# Altium schematic sheet MCU.SchDoc
size A4; SheetNumber: 2; SheetTotal: 5
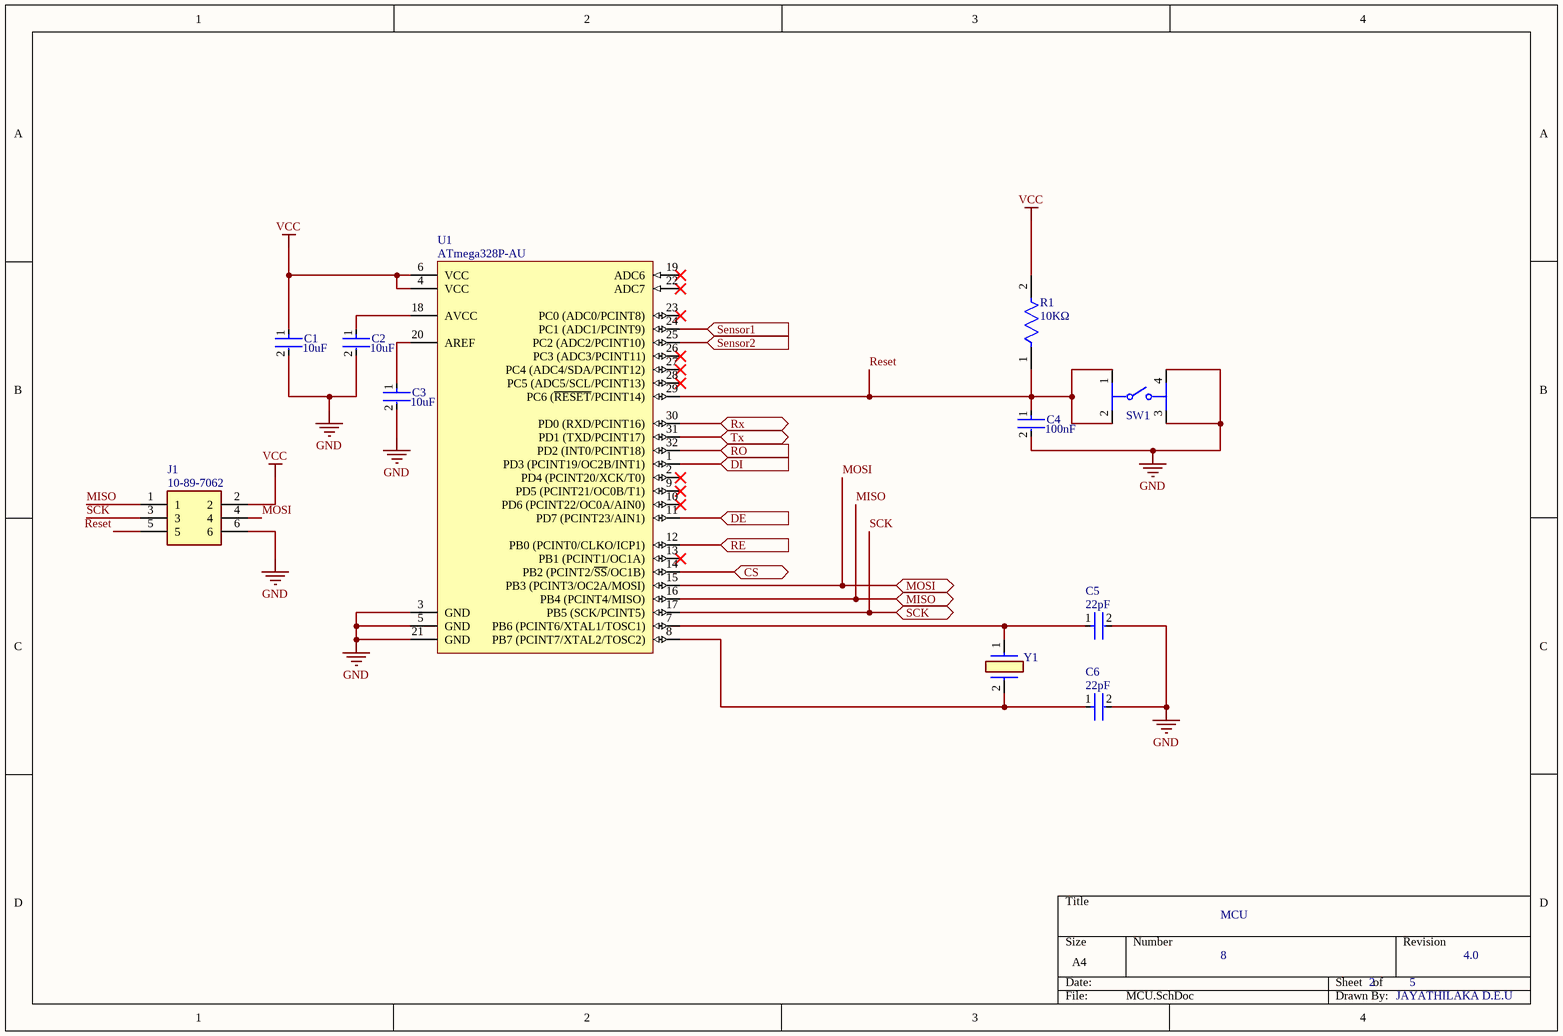
[diagram p0: MCU.SchDoc]

## Parts
C1  value 10uF  [FP-CL31B106KBHNNNE-MFG]  (hidden comment: CL31B106KBHNNNE)
C2  value 10uF  [FP-CL31B106KBHNNNE-MFG]  (hidden comment: CL31B106KBHNNNE)
C3  value 10uF  [FP-CL31B106KBHNNNE-MFG]  (hidden comment: CL31B106KBHNNNE)
C4  Capacitance: 100nF  [FP-GRM31C-0_2-e0_3_0_8-IPC_B]  (hidden comment: GRM31C5C1H104JA01L)
C5  Capacitance: 22pF  [FP-GRM31A-0_2-e0_3_0_95-IPC_C]  (hidden comment: GRM31A5C2J220JW01D)
C6  Capacitance: 22pF  [FP-GRM31A-0_2-e0_3_0_95-IPC_C]  (hidden comment: GRM31A5C2J220JW01D)
J1  10-89-7062  [HDRV6W87P254_2X3_775X508X864P]
R1  Resistance: 10KΩ  [FP-RT1206-MFG]  (hidden comment: RT1206BRD0710KL)
SW1  1571634-2  [FP-1571634-2-MFG]  (value not drawn)
U1  ATmega328P-AU  [32A_M]
Y1  ECS-160-20-3X-TR  [ECS160203XTR]  (value not drawn)

## Ports
CS (bidir, see Farm Assistor[3B], Data Logger[3C]), DE (in, see Farm Assistor[2B], Sensor inputs[4C]), DI (in, see Farm Assistor[2B], Sensor inputs[4C]), MISO (bidir, see Farm Assistor[3B], Data Logger[3C]), MOSI (bidir, see Farm Assistor[3B], Data Logger[1C]), RE (in, see Farm Assistor[2B], Sensor inputs[4C]), RO (in, see Farm Assistor[2B], Sensor inputs[4B]), Rx (bidir, see Farm Assistor[3B], Data Logger[2D]), SCK (bidir, see Farm Assistor[3B], Data Logger[1C]), Sensor1 (in, see Farm Assistor[2B], Sensor inputs[1A]), Sensor2 (in, see Farm Assistor[2B], Sensor inputs[1B]), Tx (bidir, see Farm Assistor[3B], Data Logger[2D])

## Nets
GND: C1.2 C2.2 C3.2 C4.2 C5.2 C6.2 J1.6 SW1.3 SW1.4 U1.3(GND) U1.5(GND) U1.21(GND)
VCC: C1.1 J1.2 R1.2 U1.4(VCC) U1.6(VCC)
CS: U1.14(PB2_(PCINT2/~{SS}/OC1B)) ; port CS
DE: U1.11(PD7_(PCINT23/AIN1)) ; port DE
DI: U1.1(PD3_(PCINT19/OC2B/INT1)) ; port DI
MISO: J1.1 U1.16(PB4_(PCINT4/MISO)) ; port MISO
MOSI: J1.4 U1.15(PB3_(PCINT3/OC2A/MOSI)) ; port MOSI
RE: U1.12(PB0_(PCINT0/CLKO/ICP1)) ; port RE
Reset: C4.1 J1.5 R1.1 SW1.1 SW1.2 U1.29(PC6_(~{RESET}/PCINT14))
RO: U1.32(PD2_(INT0/PCINT18)) ; port RO
Rx: U1.30(PD0_(RXD/PCINT16)) ; port Rx
SCK: J1.3 U1.17(PB5_(SCK/PCINT5)) ; port SCK
Sensor1: U1.24(PC1_(ADC1/PCINT9)) ; port Sensor1
Sensor2: U1.25(PC2_(ADC2/PCINT10)) ; port Sensor2
Tx: U1.31(PD1_(TXD/PCINT17)) ; port Tx
NetC2_1: C2.1 U1.18(AVCC)
NetC3_1: C3.1 U1.20(AREF)
NetC5_1: C5.1 U1.7(PB6_(PCINT6/XTAL1/TOSC1)) Y1.1(X1)
NetC6_1: C6.1 U1.8(PB7_(PCINT7/XTAL2/TOSC2)) Y1.2(X2)

Not connected (* = marked no-connect by the designer): U1 2(PD4_(PCINT20/XCK/T0))* 9(PD5_(PCINT21/OC0B/T1))* 10(PD6_(PCINT22/OC0A/AIN0))* 13(PB1_(PCINT1/OC1A))* 19(ADC6)* 22(ADC7)* 23(PC0_(ADC0/PCINT8))* 26(PC3_(ADC3/PCINT11))* 27(PC4_(ADC4/SDA/PCINT12))* 28(PC5_(ADC5/SCL/PCINT13))*

## Notes on the sheet
- MCU
- 8
- 2
- 5
- 4.0
- JAYATHILAKA D.E.U

## Library data of the parts
C1-C3 = CMP-2000-07530-2: CAP CER 10UF 50V X7R 1206; Manufacturer: Samsung; Tolerance: 10%; Material: Ceramic; Temperature Coefficient: 15%; Temperature Characteristic: X7R; Digikey Description: CAP CER 10UF 50V X7R 1206; Device Class L1: Passive Components; Lead Free: Yes; Device Class L3: Ceramic Capacitors; Octopart: https://octopart.com/cl31b106kbhnnne-samsung-30507377; ComponentLink2URL: http://www.samsungsem.com/global/front/downloadcms.do?path=%2F%2Fglobal%2F%2Fsupport%2F%2Fproduct-search%2F%2Fmlcc%2F%2F__icsFiles%2F%2Fafieldfile%2F%2F2019%2F%2F06%2F%2F18&fileName=CL31B106KBHNNNE-19.pdf; Voltage Rating: 50V; Temperature Range Low: -55°C; RoHS: TRUE; Temperature: -55°C to +125°C; Category: Cap; ComponentLink2Description: Datasheet; Manufacturer Part Number: CL31B106KBHNNNE; Automotive: No; Device Class L2: Capacitors; Capacitance: 10uF; Height: 1.8mm; Temperature Range High: +125°C; Package: CL31B106KBHNNNE
C4 = CMP-06035-003994-1: Chip Multilayer Ceramic Capacitors for General Purpose, 1206, 0.10uF, C0G, 30ppm/°C, 5%, 50V; Voltage: 50V; Package Quantity: 1; Min Operating Temperature: -55°C; Termination: SMD/SMT; Voltage Rating (DC): 50V; Thickness: 0.071inch; Max Operating Temperature: 125°C; Mount: Surface Mount; Height: 1.6mm; Weight: 0.000571oz; Length: 3.2mm; Case Code (Imperial): 1206; Tolerance: 5%; Lead Free: Lead Free; Material: Ceramic; REACH SVHC: No SVHC; Depth: 1.6mm; Case/Package: 1206; Radiation Hardening: No; Temperature Coefficient: 30ppm/°C; Packaging: Tape and Reel; Case Code (Metric): 3216; Dielectric: C0G; Width: 0.063inch; Voltage Rating: 50V
C5 C6 = CMP-06035-015531-1: Chip Multilayer Ceramic Capacitors for General Purpose, 1206, 22pF, C0G, 30ppm/°C, 5%, 630V; Length: 3.2mm; Case/Package: 1206; Voltage Rating (DC): 630V; Width: 0.063inch; Package Quantity: 4000; REACH SVHC: No SVHC; Radiation Hardening: No; Mount: Surface Mount; Depth: 1.6mm; Height: 1mm; Packaging: Tape and Reel; Voltage Rating: 630V; Tolerance: 5%; Termination: SMD/SMT; Thickness: 0.039inch; Case Code (Imperial): 1206; Dielectric: C0G; Lead Free: Lead Free; Case Code (Metric): 3216; Voltage: 630V; Max Operating Temperature: 125°C; Min Operating Temperature: -55°C
J1 = 10-89-7062: Connector; Manufacturer_Name: Molex; Datasheet Link: https://componentsearchengine.com/Datasheets/1/10-89-7062.pdf; Height: 8.64mm; Manufacturer_Part_Number: 10-89-7062; Mouser Part Number: 538-10-89-7062; Mouser Price/Stock: https://www.mouser.co.uk/ProductDetail/Molex/10-89-7062?qs=tRPrwvvr%2Fuh8n6rY9aRt4Q%3D%3D
R1 = CMP-2003-04273-2: RES 10.0K OHM 1/4W .1% SMD 1206; Manufacturer: Yageo; Power Rating: 0.25W; Temperature Coefficient: 25 ppm/°C; Voltage Rating: 200V; Value: 10KΩ; Tolerance: 0.005; ComponentLink2URL: http://www.yageo.com/documents/recent/PYu-RT_1-to-0.01_RoHS_L_9.pdf; ComponentLink2Description: Datasheet; Series: RT; Octopart: https://octopart.com/rt1206brd0710kl-yageo-1397513; Footprint Url: http://www.yageo.com/exep/pages/download/literatures/PYu-R_Mount_10.pdf; Manufacturer Part Number: RT1206BRD0710KL; Temperature: -55°C to +155°C; Digikey Description: RES 10.0K OHM 1/4W .1% SMD 1206; Ipc Land Pattern Name: RESC310160X55; Temperature Range Low: -55°C; Mouser Description: High Precision-High Stability Chip Resistor Thin Film 1206 10kOhm 0.1% Paper T/R; Composition: Thin Film; Category: Res; Temperature Range High: +155°C; Device Class L1: Passive Components; Height: 0.65mm; Package: RT1206; Lead Free: Yes; RoHS: TRUE; Device Class L2: Resistors; Device Class L3: Chip SMD Resistors; Automotive: No
SW1 = CMP-03407-000008-1: SWITCH TACTILE SPST-NO 0.05A 24V; Actuator Length: 0.094inch; Max Current Rating: 50mA; Voltage Rating (DC): 12V; Actuator Material: Rubber; Switch Function: Off-Mom; Mechanical Life: 5000000Cycles; Actuator Type: Standard; Actuator Color: Natural; Illumination Type: Illuminated; Operating Force: 160gf; Throw Configuration: SPST; Package Quantity: 1000; Max Operating Temperature: 85°C; Mount: Surface Mount; Contact Plating: Silver; Depth: 10mm; Min Operating Temperature: -40°C; Radiation Hardening: No; ELV: Compliant; Case/Package: SMD/SMT; Length: 6.2mm; Termination: Gull Wing; Type: Switch; RoHS Compliant: Yes; Current Rating: 50mA; Contact Current Rating: 50mA; Orientation: Straight; Packaging: Tape and Reel; Max Voltage Rating (DC): 12V; Lead Free: Lead Free; Contact Material: Stainless Steel
U1 = CMP-0095-00269-2: 8-bit AVR Microcontroller, 32KB Flash, 1KB EEPROM, 2KB SRAM, 32-pin TQFP, Industrial Grade (-40°C to 85°C); PackageDescription: 32-Lead, 7x7x1.0 mm Body, 0.8mm Lead Pitch, Thin Profile Plastic Quad Flat Package (TQFP); DatasheetVersion: revD, May-2011; RevisionNote: DatasheetVersion & PackageVersion updated. URLs added.; ComponentLink1URL: http://www.atmel.com/; ComponentLink2Description: ATmega48A/48PA/88A/88PA/168A/168PA/328/328P Datasheet; Code_JEDEC: MS-026-ABA; ComponentLink1Description: Manufacturer URL; PackageReference: 32A; ComponentLink3Description: ATmega48A/48PA/88A/88PA/168A/168PA/328/328P Summary; ComponentLink2URL: http://www.atmel.com/dyn/resources/prod_documents/doc8271.pdf; PackageVersion: revC, Oct-2010; ComponentLink3URL: http://www.atmel.com/dyn/resources/prod_documents/8271S.pdf
Y1 = ECS-160-20-3X-TR: Crystal or Oscillator; Manufacturer_Name: ECS; Datasheet Link: https://www.arrow.com/en/products/ecs-160-20-3x-tr/ecs-international; Height: 2.3mm; Manufacturer_Part_Number: ECS-160-20-3X-TR; Mouser Part Number: 520-160-20-3XT; Mouser Price/Stock: https://www.mouser.co.uk/ProductDetail/ECS/ECS-160-20-3X-TR?qs=7Z%2FjUg96RbU1ElbRFXn8Rw%3D%3D; Arrow Part Number: ECS-160-20-3X-TR; Arrow Price/Stock: https://www.arrow.com/en/products/ecs-160-20-3x-tr/ecs-international?region=nac